# EAGLE design twometertx-micrf300 (EAGLE 7.3.0)
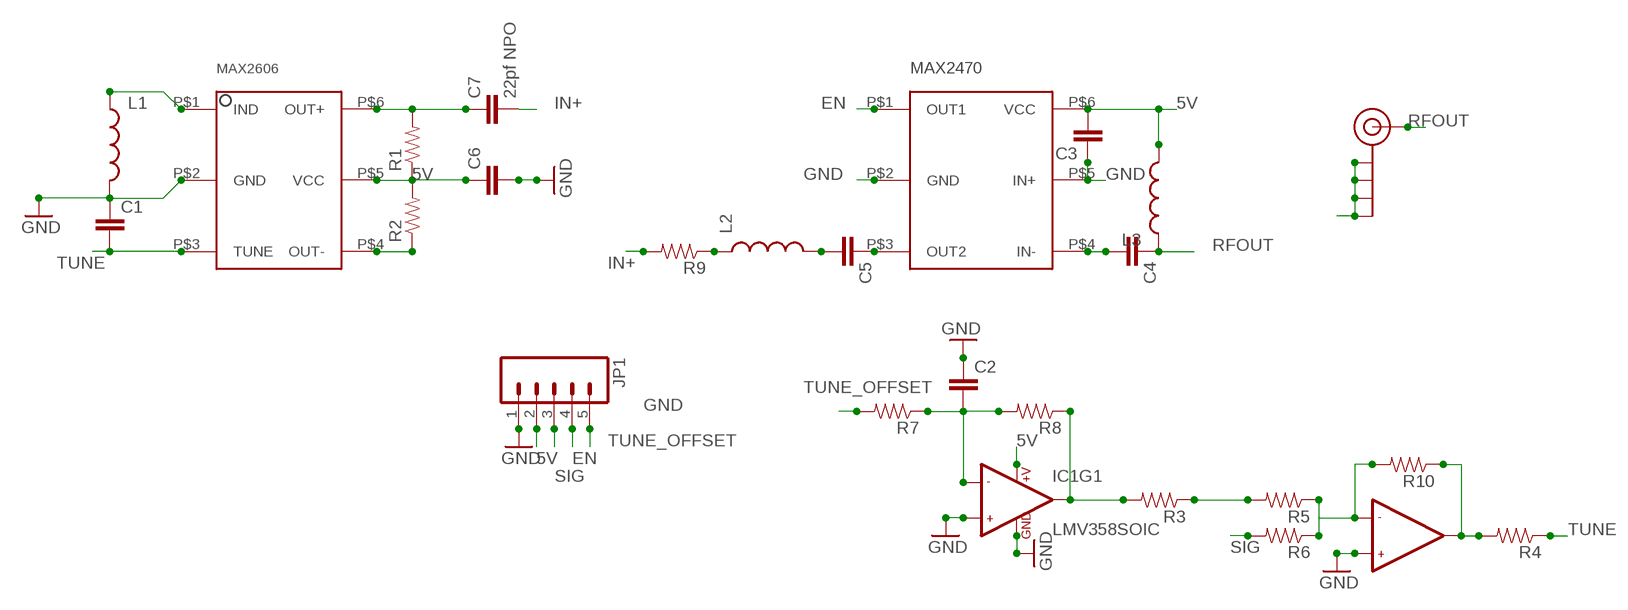
[diagram p0: schematic, sheet 1]

## Parts
C1  CAP0805  [0805]
C2  CAP0805  [0805]
C3  CAP0805  [0805]
C4  CAP0805  [0805]
C5  CAP0805  [0805]
C6  CAP0805  [0805]
C7  22pf NPO  CAP0805  [0805]
IC1  LMV358SOIC  [SO08]
J$1  SMA_EDGE  [SMA-EDGE]
JP1  M05PTH_LONGPADS  [1X05_LONGPADS]
L1  INDUCTOR0805  [0805]
L2  INDUCTOR0805  [0805]
L3  INDUCTOR0805  [0805]
R1  RESISTOR0805-RES  [0805]
R2  RESISTOR0805-RES  [0805]
R3  RESISTOR0805-RES  [0805]
R4  RESISTOR0805-RES  [0805]
R5  RESISTOR0805-RES  [0805]
R6  RESISTOR0805-RES  [0805]
R7  RESISTOR0805-RES  [0805]
R8  RESISTOR0805-RES  [0805]
R9  RESISTOR0805-RES  [0805]
R10  RESISTOR0805-RES  [0805]
U$1  MAX2606  [MAX2606]
U$2  MAX2470  [MAX2470]

## Nets
5V: C3.2 C6.1 IC1.8(+V) JP1.2 L3.2 R1.1 R2.2 U$1.P$5(VCC) U$2.P$6(VCC)
EN: JP1.4 U$2.P$1(OUT1)
GND: C1.1 C2.1 C3.1 C4.2 C6.2 IC1.3(+IN1) IC1.4(GND) IC1.5(+IN2) J$1.GND@0(GND) J$1.GND@1(GND) J$1.GND@2(GND) J$1.GND@3(GND) JP1.1 L1.2 U$1.P$2(GND) U$2.P$2(GND) U$2.P$4(IN-) U$2.P$5(IN+)
IN+: C7.2 R9.2
N$1: C5.1 U$2.P$3(OUT2)
N$2: L1.1 U$1.P$1(IND)
N$3: C2.2 IC1.2(-IN1) R7.1 R8.2
N$4: C5.2 L2.2
N$5: R3.1 R5.2
N$6: IC1.7(OUT2) R4.2 R10.1
N$7: IC1.6(-IN2) R5.1 R6.1 R10.2
N$8: L2.1 R9.1
N$9: C7.1 R1.2 U$1.P$6(OUT+)
N$11: IC1.1(OUT1) R3.2 R8.1
RFOUT: C4.1 J$1.SIG(SIGNAL) L3.1
SIG: JP1.3 R6.2
THING2: R2.1 U$1.P$4(OUT-)
TUNE: C1.2 R4.1 U$1.P$3(TUNE)
TUNE_OFFSET: JP1.5 R7.2

## Library data of the parts
C1-C7 = SparkFun-Capacitors:CAP: Capacitor Standard 0603 ceramic capacitor, and 0.1" leaded capacitor.
IC1 = SparkFun-AnalogIC:LMV358: Jellybean rail-to-rail output op-amp; PROD_ID: IC-09657
J$1 = SparkFun-Connectors:SMA_EDGE: SMA Antenna Connector End launch SMA connector. The paste layer has been removed so that the connector can be hand soldered onto the board after reflow.
JP1 = SparkFun-Connectors:M05: Header 5 Standard 5-pin 0.1" header. Use with straight break away headers (SKU : PRT-00116), right angle break away headers (PRT-00553), swiss pins (PRT-00743), machine pins (PRT-00117), and female headers (PRT-00115). Molex polarized connector foot print use with SKU : PRT-08230 with associated crimp pins and housings.
L1-L3 = SparkFun-Passives:INDUCTOR: Inductors Basic Inductor/Choke - 0603 and 1206. Footprints are not proven and vary greatly between part numbers. SRN6045- 33uH, 20% 1.4A SDR0403-560KL - 56uH, 10%, 500mA RMS/740mA peak
R1-R10 = SparkFun-Passives:RESISTOR: Resistor Basic schematic elements and footprints for 0603, 1206, and PTH resistors.
U$1 = MAX2606:MAX2606: MAX2606 RF transmitter in SOT 23-6 package
U$2 = MAX2470:MAX2470

## Board
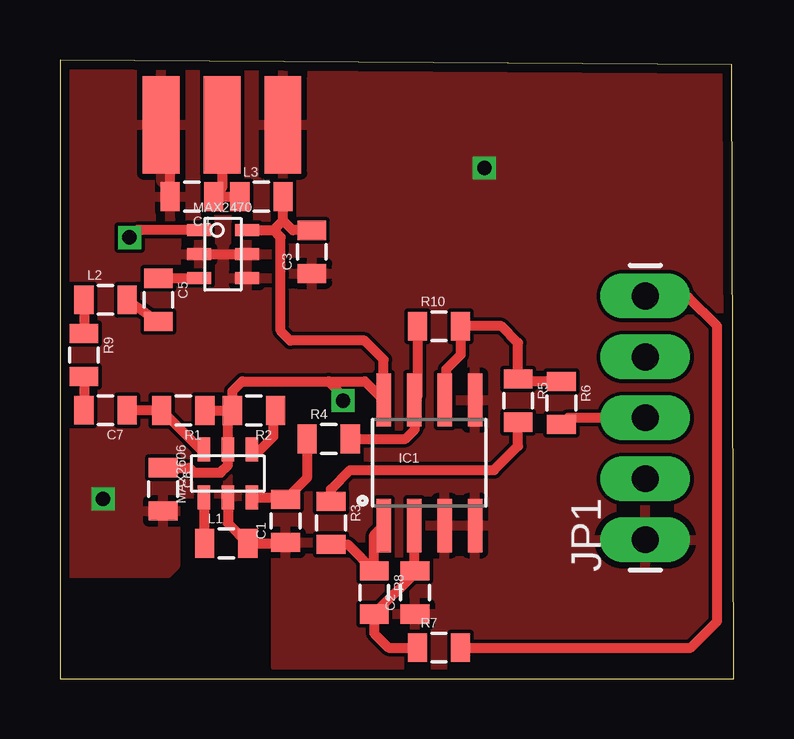
[diagram p1: board, top side]
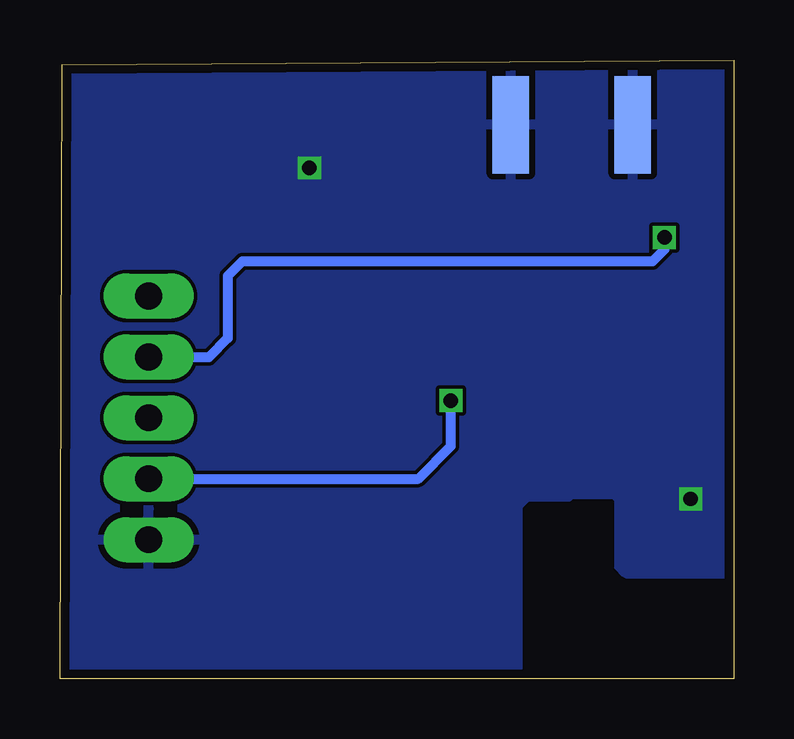
[diagram p2: board, bottom side, seen from below]

Size 28.1 x 25.8 mm. Coordinates in mm from the lower left corner, seen from the top.
Outline: 0,0 28.1,0 28,25.6 0,25.8 0,0
Copper layers (1*16): Top 0.0356mm / dielectric 1.5011mm / Bottom 0.0356mm
Design rules "oshpark-2layer": minimum track width 6mil, minimum drill 13mil, track to track 6mil, track to pad 6mil, pad to pad 6mil, via to via 6mil, smd to smd 6mil, copper to edge 15mil, drill to drill 6mil, minimum pad ring 7mil, minimum via ring 7mil, stop-mask expansion 4mil, vias tented up to drill 0mil, thermal gap 10mil

### Footprints (pad centres in the part's own frame; a part is rotated, then mirrored left to right if it is on the bottom)
0805 = smd 0.8 x 1.2: 1 -0.9,0; 2 0.9,0
SO08 = smd 0.61 x 2.21: 1 -1.905,-2.616; 2 -0.635,-2.616; 3 0.635,-2.616; 4 1.905,-2.616; 5 1.905,2.616; 6 0.635,2.616; 7 -0.635,2.616; 8 -1.905,2.616
SMA-EDGE = smd 1.524 x 4.064: GND@0 0,0; GND@1 5.08,0; SIG 2.54,0 | smd 1.524 x 4.064 bottom: GND@2 0,0; GND@3 5.08,0
1X05_LONGPADS = drill 1.118 pad 1.88 long: 1 0,0; 2 2.54,0; 3 5.08,0; 4 7.62,0; 5 10.16,0
MAX2606 = smd 0.508 x 1.016: P$1 -1,-1; P$2 0,-1; P$3 1,-1; P$4 1,1; P$5 0,1; P$6 -1,1
MAX2470 = smd 0.508 x 1.016: P$1 -1,-1; P$2 0,-1; P$3 1,-1; P$4 1,1; P$5 0,1; P$6 -1,1

### Placement (x,y rotation side)
C1  9.41,6.58 90 top
C2  14.8,3.6 90 top
C3  10.5,17.8 90 top
C4  5.5,20.1 180 top
C5  4.1,15.8 270 top
C6  4.3,7.9 270 top
C7  1.9,11.2 180 top
IC1  15.4,9 0 top
J$1  9.3,23.1 180 top
JP1  24.4,5.8 90 top
L1  6.93,5.65 0 top
L2  1.9,15.8 0 top
L3  8.4,20.1 0 top
R1  5.14,11.19 180 top
R2  8.09,11.19 180 top
R3  11.3,6.5 270 top
R4  11.2,10 0 top
R5  19.1,11.6 270 top
R6  20.9,11.5 270 top
R7  15.8,1.3 0 top
R8  13.1,3.6 270 top
R9  1,13.5 270 top
R10  15.8,14.7 0 top
U$1  7,8.56 0 top
U$2  6.8,17.7 270 top

### Tracks (layer width: path | path; a pad name or v marks a point on that pad's centre or on a via)
5V  (via drill 0.6)
  Top 0.406: C6.1 5.4,8.8 5.6,8.6 6.7,8.6 7,8.9 U$1.P$5 7,11 R2.2 | R1.1 R2.2 | R2.2 7.19,11.99 7.6,12.4 11.2,12.4 | 11.2,12.4 12.71,12.4 IC1.8 13.5,13.3 12.7,14.1 9.6,14.1 9.2,14.5 9.2,18.4 8.9,18.7 | U$2.P$6 8.9,18.7 | 8.9,18.7 9.3,19.1 | 9.3,19.1 L3.2 | C3.2 9.7,18.7 9.3,19.1 | v11.8,11.6 11.8,11.8 11.2,12.4
  Bottom 0.406: JP1.2 13.16,8.34 11.8,9.7 v11.8,11.6
EN  (via drill 0.6)
  Top 0.406: U$2.P$1 3.2,18.7 v2.9,18.4
  Bottom 0.406: v2.9,18.4 2.9,17.9 3.4,17.4 20.5,17.4 21.1,16.8 21.1,14.2 21.9,13.4 24.38,13.4 JP1.4
GND  (via drill 0.6)
  Top 0.406: C1.1 9.38,5.65 L1.2 7,6.48 U$1.P$2 | U$2.P$2 U$2.P$5 | C4.2 4.6,22.72 J$1.GND@1
  other vias: 1.8,7.5 17.7,21.3
  pour Top: 6.8,7.7 5,7.7 4.8,7.5 4.8,4.7 4.5,4.4 -0.9,4.4 -1.1,4.6 -1,25.7 -0.7,26 27.7,26 28.1,25.6 28.1,0.4 27.7,0 9.5,0 9,0.5 9,7.2 8.6,7.6 6.9,7.6
  pour Bottom: 6.8,7.7 5,7.7 4.8,7.5 4.8,4.7 4.5,4.4 -0.9,4.4 -1.1,4.6 -1.1,25.6 -0.7,26 27.7,26 28.1,25.6 28.1,0.4 27.7,0 9.5,0 9,0.5 9,7.2 8.6,7.6 6.9,7.6
IN+
  Top 0.406: R9.2 C7.2
N$1
  Top 0.406: C5.1 U$2.P$3
N$2
  Top 0.406: U$1.P$1 6,5.68 L1.1
N$3
  Top 0.406: IC1.2 14.77,4.54 C2.2 14.8,4.4 R8.2 13.1,1.9 13.7,1.3 R7.1
N$4
  Top 0.406: L2.2 C5.2
N$5
  Top 0.406: R3.1 11.3,7.9 12.1,8.7 18.1,8.7 19.1,9.7 R5.2
N$6
  Top 0.406: R4.2 14.4,10 14.8,10.4 14.8,11.58 IC1.7 14.9,11.75 R10.1
N$7
  Top 0.406: IC1.6 16.1,11.68 16.1,12.9 16.7,13.5 R10.2 18.4,14.7 19.1,14 R5.1 19.2,12.4 R6.1
N$8
  Top 0.406: L2.1 R9.1
N$9
  Top 0.406: C7.1 R1.2 5.87,9.56 U$1.P$6
N$11
  Top 0.406: R3.2 12,5.6 R8.1 13.1,5.99 IC1.1
RFOUT
  Top 0.406: L3.1 C4.1 6.76,20.46 J$1.SIG
SIG
  Top 0.406: JP1.3 21.18,10.88 R6.2
THING2
  Top 0.406: U$1.P$4 8.36,9.56 8.9,10.1 8.9,11.1 R2.1
TUNE
  Top 0.406: U$1.P$3 9.33,7.56 C1.2 10.3,8.37 R4.1
TUNE_OFFSET
  Top 0.406: R7.2 26.3,1.3 27.4,2.4 27.4,14.7 26.2,15.9 24.46,15.9 JP1.5